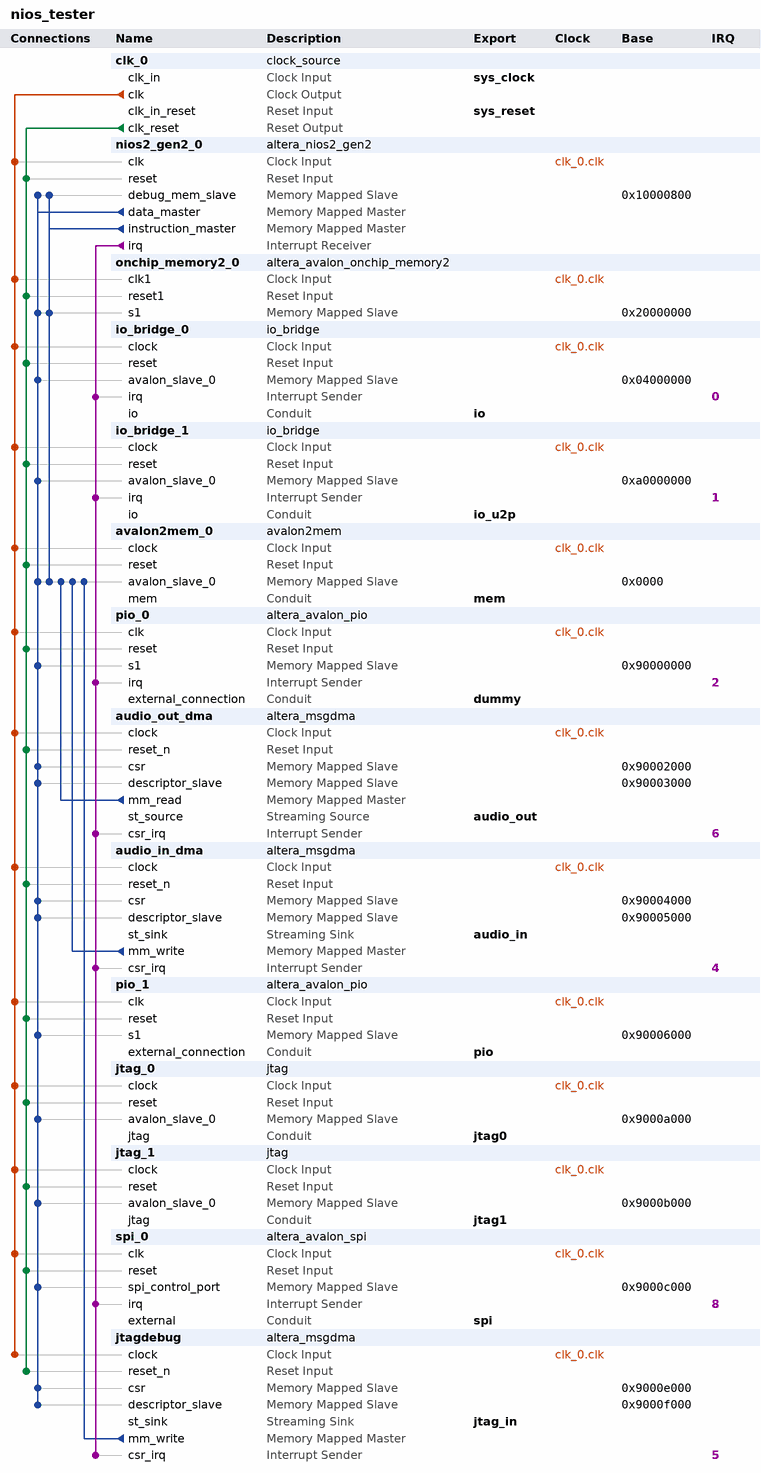
[diagram p0: system contents]
# Platform Designer (Qsys) system nios_tester, Cyclone IV E EP4CE22F17C8
# Parameters at their usual value, and those the tool derives, are not listed.
package require -exact qsys 18.1
create_system nios_tester
set_project_property DEVICE_FAMILY {Cyclone IV E}
set_project_property DEVICE EP4CE22F17C8

add_instance clk_0 clock_source 18.1
set_instance_parameter_value clk_0 clockFrequency 62500000
set_instance_parameter_value clk_0 resetSynchronousEdges DEASSERT

add_instance nios2_gen2_0 altera_nios2_gen2 18.1
set_instance_parameter_value nios2_gen2_0 dcache_size 2048
set_instance_parameter_value nios2_gen2_0 exceptionOffset 0
set_instance_parameter_value nios2_gen2_0 exceptionSlave avalon2mem_0.avalon_slave_0
set_instance_parameter_value nios2_gen2_0 icache_size 4096
set_instance_parameter_value nios2_gen2_0 impl Tiny
set_instance_parameter_value nios2_gen2_0 io_regionbase -2147483648
set_instance_parameter_value nios2_gen2_0 io_regionsize 1073741824
set_instance_parameter_value nios2_gen2_0 resetSlave onchip_memory2_0.s1
set_instance_parameter_value nios2_gen2_0 setting_support31bitdcachebypass false

add_instance onchip_memory2_0 altera_avalon_onchip_memory2 18.1
set_instance_parameter_value onchip_memory2_0 dataWidth 32
set_instance_parameter_value onchip_memory2_0 dualPort false
set_instance_parameter_value onchip_memory2_0 initMemContent true
set_instance_parameter_value onchip_memory2_0 initializationFileName onchip_mem.hex
set_instance_parameter_value onchip_memory2_0 memorySize 2048
set_instance_parameter_value onchip_memory2_0 useNonDefaultInitFile true

add_instance io_bridge_0 io_bridge 1.0

add_instance io_bridge_1 io_bridge 1.0

add_instance avalon2mem_0 avalon2mem 1.0
set_instance_parameter_value avalon2mem_0 g_tag 91

add_instance pio_0 altera_avalon_pio 18.1
set_instance_parameter_value pio_0 direction Input
set_instance_parameter_value pio_0 generateIRQ true
set_instance_parameter_value pio_0 width 1

add_instance audio_out_dma altera_msgdma 18.1
set_instance_parameter_value audio_out_dma BURST_ENABLE 0
set_instance_parameter_value audio_out_dma DATA_FIFO_DEPTH 256
set_instance_parameter_value audio_out_dma DATA_WIDTH 32
set_instance_parameter_value audio_out_dma DESCRIPTOR_FIFO_DEPTH 8
set_instance_parameter_value audio_out_dma ENHANCED_FEATURES 0
set_instance_parameter_value audio_out_dma ERROR_ENABLE 0
set_instance_parameter_value audio_out_dma MAX_BURST_COUNT 2
set_instance_parameter_value audio_out_dma MAX_BYTE 1048576
set_instance_parameter_value audio_out_dma MODE 1
set_instance_parameter_value audio_out_dma PACKET_ENABLE 0
set_instance_parameter_value audio_out_dma TRANSFER_TYPE {Full Word Accesses Only}

add_instance audio_in_dma altera_msgdma 18.1
set_instance_parameter_value audio_in_dma BURST_ENABLE 0
set_instance_parameter_value audio_in_dma DATA_FIFO_DEPTH 256
set_instance_parameter_value audio_in_dma DATA_WIDTH 32
set_instance_parameter_value audio_in_dma DESCRIPTOR_FIFO_DEPTH 8
set_instance_parameter_value audio_in_dma ENHANCED_FEATURES 0
set_instance_parameter_value audio_in_dma ERROR_ENABLE 0
set_instance_parameter_value audio_in_dma MAX_BURST_COUNT 2
set_instance_parameter_value audio_in_dma MAX_BYTE 1048576
set_instance_parameter_value audio_in_dma MODE 2
set_instance_parameter_value audio_in_dma PACKET_ENABLE 0
set_instance_parameter_value audio_in_dma TRANSFER_TYPE {Full Word Accesses Only}

add_instance pio_1 altera_avalon_pio 18.1
set_instance_parameter_value pio_1 bitModifyingOutReg true
set_instance_parameter_value pio_1 direction InOut
set_instance_parameter_value pio_1 width 32

add_instance jtag_0 jtag 1.0

add_instance jtag_1 jtag 1.0

add_instance spi_0 altera_avalon_spi 18.1
set_instance_parameter_value spi_0 clockPolarity 0
set_instance_parameter_value spi_0 dataWidth 8
set_instance_parameter_value spi_0 masterSPI true
set_instance_parameter_value spi_0 numberOfSlaves 1
set_instance_parameter_value spi_0 targetClockRate 2000000

add_instance jtagdebug altera_msgdma 18.1
set_instance_parameter_value jtagdebug BURST_ENABLE 0
set_instance_parameter_value jtagdebug DATA_FIFO_DEPTH 256
set_instance_parameter_value jtagdebug DATA_WIDTH 8
set_instance_parameter_value jtagdebug DESCRIPTOR_FIFO_DEPTH 8
set_instance_parameter_value jtagdebug ENHANCED_FEATURES 0
set_instance_parameter_value jtagdebug ERROR_ENABLE 0
set_instance_parameter_value jtagdebug MAX_BURST_COUNT 2
set_instance_parameter_value jtagdebug MAX_BYTE 8388608
set_instance_parameter_value jtagdebug MODE 2
set_instance_parameter_value jtagdebug PACKET_ENABLE 0
set_instance_parameter_value jtagdebug TRANSFER_TYPE {Aligned Accesses}

# connections
add_connection clk_0.clk audio_in_dma.clock clock
add_connection clk_0.clk audio_out_dma.clock clock
add_connection clk_0.clk avalon2mem_0.clock clock
add_connection clk_0.clk io_bridge_0.clock clock
add_connection clk_0.clk io_bridge_1.clock clock
add_connection clk_0.clk jtag_0.clock clock
add_connection clk_0.clk jtag_1.clock clock
add_connection clk_0.clk jtagdebug.clock clock
add_connection clk_0.clk nios2_gen2_0.clk clock
add_connection clk_0.clk onchip_memory2_0.clk1 clock
add_connection clk_0.clk pio_0.clk clock
add_connection clk_0.clk pio_1.clk clock
add_connection clk_0.clk spi_0.clk clock
add_connection clk_0.clk_reset audio_in_dma.reset_n reset
add_connection clk_0.clk_reset audio_out_dma.reset_n reset
add_connection clk_0.clk_reset avalon2mem_0.reset reset
add_connection clk_0.clk_reset io_bridge_0.reset reset
add_connection clk_0.clk_reset io_bridge_1.reset reset
add_connection clk_0.clk_reset jtag_0.reset reset
add_connection clk_0.clk_reset jtag_1.reset reset
add_connection clk_0.clk_reset jtagdebug.reset_n reset
add_connection clk_0.clk_reset nios2_gen2_0.reset reset
add_connection clk_0.clk_reset onchip_memory2_0.reset1 reset
add_connection clk_0.clk_reset pio_0.reset reset
add_connection clk_0.clk_reset pio_1.reset reset
add_connection clk_0.clk_reset spi_0.reset reset
add_connection audio_in_dma.mm_write avalon2mem_0.avalon_slave_0 avalon
set_connection_parameter_value audio_in_dma.mm_write/avalon2mem_0.avalon_slave_0 baseAddress 0x0000
add_connection audio_out_dma.mm_read avalon2mem_0.avalon_slave_0 avalon
set_connection_parameter_value audio_out_dma.mm_read/avalon2mem_0.avalon_slave_0 baseAddress 0x0000
add_connection jtagdebug.mm_write avalon2mem_0.avalon_slave_0 avalon
set_connection_parameter_value jtagdebug.mm_write/avalon2mem_0.avalon_slave_0 baseAddress 0x0000
add_connection nios2_gen2_0.data_master audio_in_dma.csr avalon
set_connection_parameter_value nios2_gen2_0.data_master/audio_in_dma.csr baseAddress 0x90004000
add_connection nios2_gen2_0.data_master audio_in_dma.descriptor_slave avalon
set_connection_parameter_value nios2_gen2_0.data_master/audio_in_dma.descriptor_slave baseAddress 0x90005000
add_connection nios2_gen2_0.data_master audio_out_dma.csr avalon
set_connection_parameter_value nios2_gen2_0.data_master/audio_out_dma.csr baseAddress 0x90002000
add_connection nios2_gen2_0.data_master audio_out_dma.descriptor_slave avalon
set_connection_parameter_value nios2_gen2_0.data_master/audio_out_dma.descriptor_slave baseAddress 0x90003000
add_connection nios2_gen2_0.data_master avalon2mem_0.avalon_slave_0 avalon
set_connection_parameter_value nios2_gen2_0.data_master/avalon2mem_0.avalon_slave_0 baseAddress 0x0000
add_connection nios2_gen2_0.data_master io_bridge_0.avalon_slave_0 avalon
set_connection_parameter_value nios2_gen2_0.data_master/io_bridge_0.avalon_slave_0 baseAddress 0x04000000
add_connection nios2_gen2_0.data_master io_bridge_1.avalon_slave_0 avalon
set_connection_parameter_value nios2_gen2_0.data_master/io_bridge_1.avalon_slave_0 baseAddress 0xa0000000
add_connection nios2_gen2_0.data_master jtag_0.avalon_slave_0 avalon
set_connection_parameter_value nios2_gen2_0.data_master/jtag_0.avalon_slave_0 baseAddress 0x9000a000
add_connection nios2_gen2_0.data_master jtag_1.avalon_slave_0 avalon
set_connection_parameter_value nios2_gen2_0.data_master/jtag_1.avalon_slave_0 baseAddress 0x9000b000
add_connection nios2_gen2_0.data_master jtagdebug.csr avalon
set_connection_parameter_value nios2_gen2_0.data_master/jtagdebug.csr baseAddress 0x9000e000
add_connection nios2_gen2_0.data_master jtagdebug.descriptor_slave avalon
set_connection_parameter_value nios2_gen2_0.data_master/jtagdebug.descriptor_slave baseAddress 0x9000f000
add_connection nios2_gen2_0.data_master nios2_gen2_0.debug_mem_slave avalon
set_connection_parameter_value nios2_gen2_0.data_master/nios2_gen2_0.debug_mem_slave baseAddress 0x10000800
add_connection nios2_gen2_0.data_master onchip_memory2_0.s1 avalon
set_connection_parameter_value nios2_gen2_0.data_master/onchip_memory2_0.s1 baseAddress 0x20000000
add_connection nios2_gen2_0.data_master pio_0.s1 avalon
set_connection_parameter_value nios2_gen2_0.data_master/pio_0.s1 baseAddress 0x90000000
add_connection nios2_gen2_0.data_master pio_1.s1 avalon
set_connection_parameter_value nios2_gen2_0.data_master/pio_1.s1 baseAddress 0x90006000
add_connection nios2_gen2_0.data_master spi_0.spi_control_port avalon
set_connection_parameter_value nios2_gen2_0.data_master/spi_0.spi_control_port baseAddress 0x9000c000
add_connection nios2_gen2_0.instruction_master avalon2mem_0.avalon_slave_0 avalon
set_connection_parameter_value nios2_gen2_0.instruction_master/avalon2mem_0.avalon_slave_0 baseAddress 0x0000
add_connection nios2_gen2_0.instruction_master nios2_gen2_0.debug_mem_slave avalon
set_connection_parameter_value nios2_gen2_0.instruction_master/nios2_gen2_0.debug_mem_slave baseAddress 0x10000800
add_connection nios2_gen2_0.instruction_master onchip_memory2_0.s1 avalon
set_connection_parameter_value nios2_gen2_0.instruction_master/onchip_memory2_0.s1 baseAddress 0x20000000
add_connection nios2_gen2_0.irq audio_in_dma.csr_irq interrupt
set_connection_parameter_value nios2_gen2_0.irq/audio_in_dma.csr_irq irqNumber 4
add_connection nios2_gen2_0.irq audio_out_dma.csr_irq interrupt
set_connection_parameter_value nios2_gen2_0.irq/audio_out_dma.csr_irq irqNumber 6
add_connection nios2_gen2_0.irq io_bridge_0.irq interrupt
set_connection_parameter_value nios2_gen2_0.irq/io_bridge_0.irq irqNumber 0
add_connection nios2_gen2_0.irq io_bridge_1.irq interrupt
set_connection_parameter_value nios2_gen2_0.irq/io_bridge_1.irq irqNumber 1
add_connection nios2_gen2_0.irq jtagdebug.csr_irq interrupt
set_connection_parameter_value nios2_gen2_0.irq/jtagdebug.csr_irq irqNumber 5
add_connection nios2_gen2_0.irq pio_0.irq interrupt
set_connection_parameter_value nios2_gen2_0.irq/pio_0.irq irqNumber 2
add_connection nios2_gen2_0.irq spi_0.irq interrupt
set_connection_parameter_value nios2_gen2_0.irq/spi_0.irq irqNumber 8

# exported interfaces
add_interface audio_in avalon_streaming sink
set_interface_property audio_in EXPORT_OF audio_in_dma.st_sink
add_interface audio_out avalon_streaming source
set_interface_property audio_out EXPORT_OF audio_out_dma.st_source
add_interface dummy conduit end
set_interface_property dummy EXPORT_OF pio_0.external_connection
add_interface io conduit end
set_interface_property io EXPORT_OF io_bridge_0.io
add_interface io_u2p conduit end
set_interface_property io_u2p EXPORT_OF io_bridge_1.io
add_interface jtag0 conduit end
set_interface_property jtag0 EXPORT_OF jtag_0.jtag
add_interface jtag1 conduit end
set_interface_property jtag1 EXPORT_OF jtag_1.jtag
add_interface jtag_in avalon_streaming sink
set_interface_property jtag_in EXPORT_OF jtagdebug.st_sink
add_interface mem conduit end
set_interface_property mem EXPORT_OF avalon2mem_0.mem
add_interface pio conduit end
set_interface_property pio EXPORT_OF pio_1.external_connection
add_interface spi conduit end
set_interface_property spi EXPORT_OF spi_0.external
add_interface sys_clock clock sink
set_interface_property sys_clock EXPORT_OF clk_0.clk_in
add_interface sys_reset reset sink
set_interface_property sys_reset EXPORT_OF clk_0.clk_in_reset

set_interconnect_requirement {$system} qsys_mm.clockCrossingAdapter HANDSHAKE
set_interconnect_requirement {$system} qsys_mm.enableEccProtection FALSE
set_interconnect_requirement {$system} qsys_mm.insertDefaultSlave FALSE
set_interconnect_requirement {$system} qsys_mm.maxAdditionalLatency 1

save_system nios_tester.qsys
